# Altium schematic sheet Processor.SchDoc
size A2; SheetNumber: 3; SheetTotal: 4
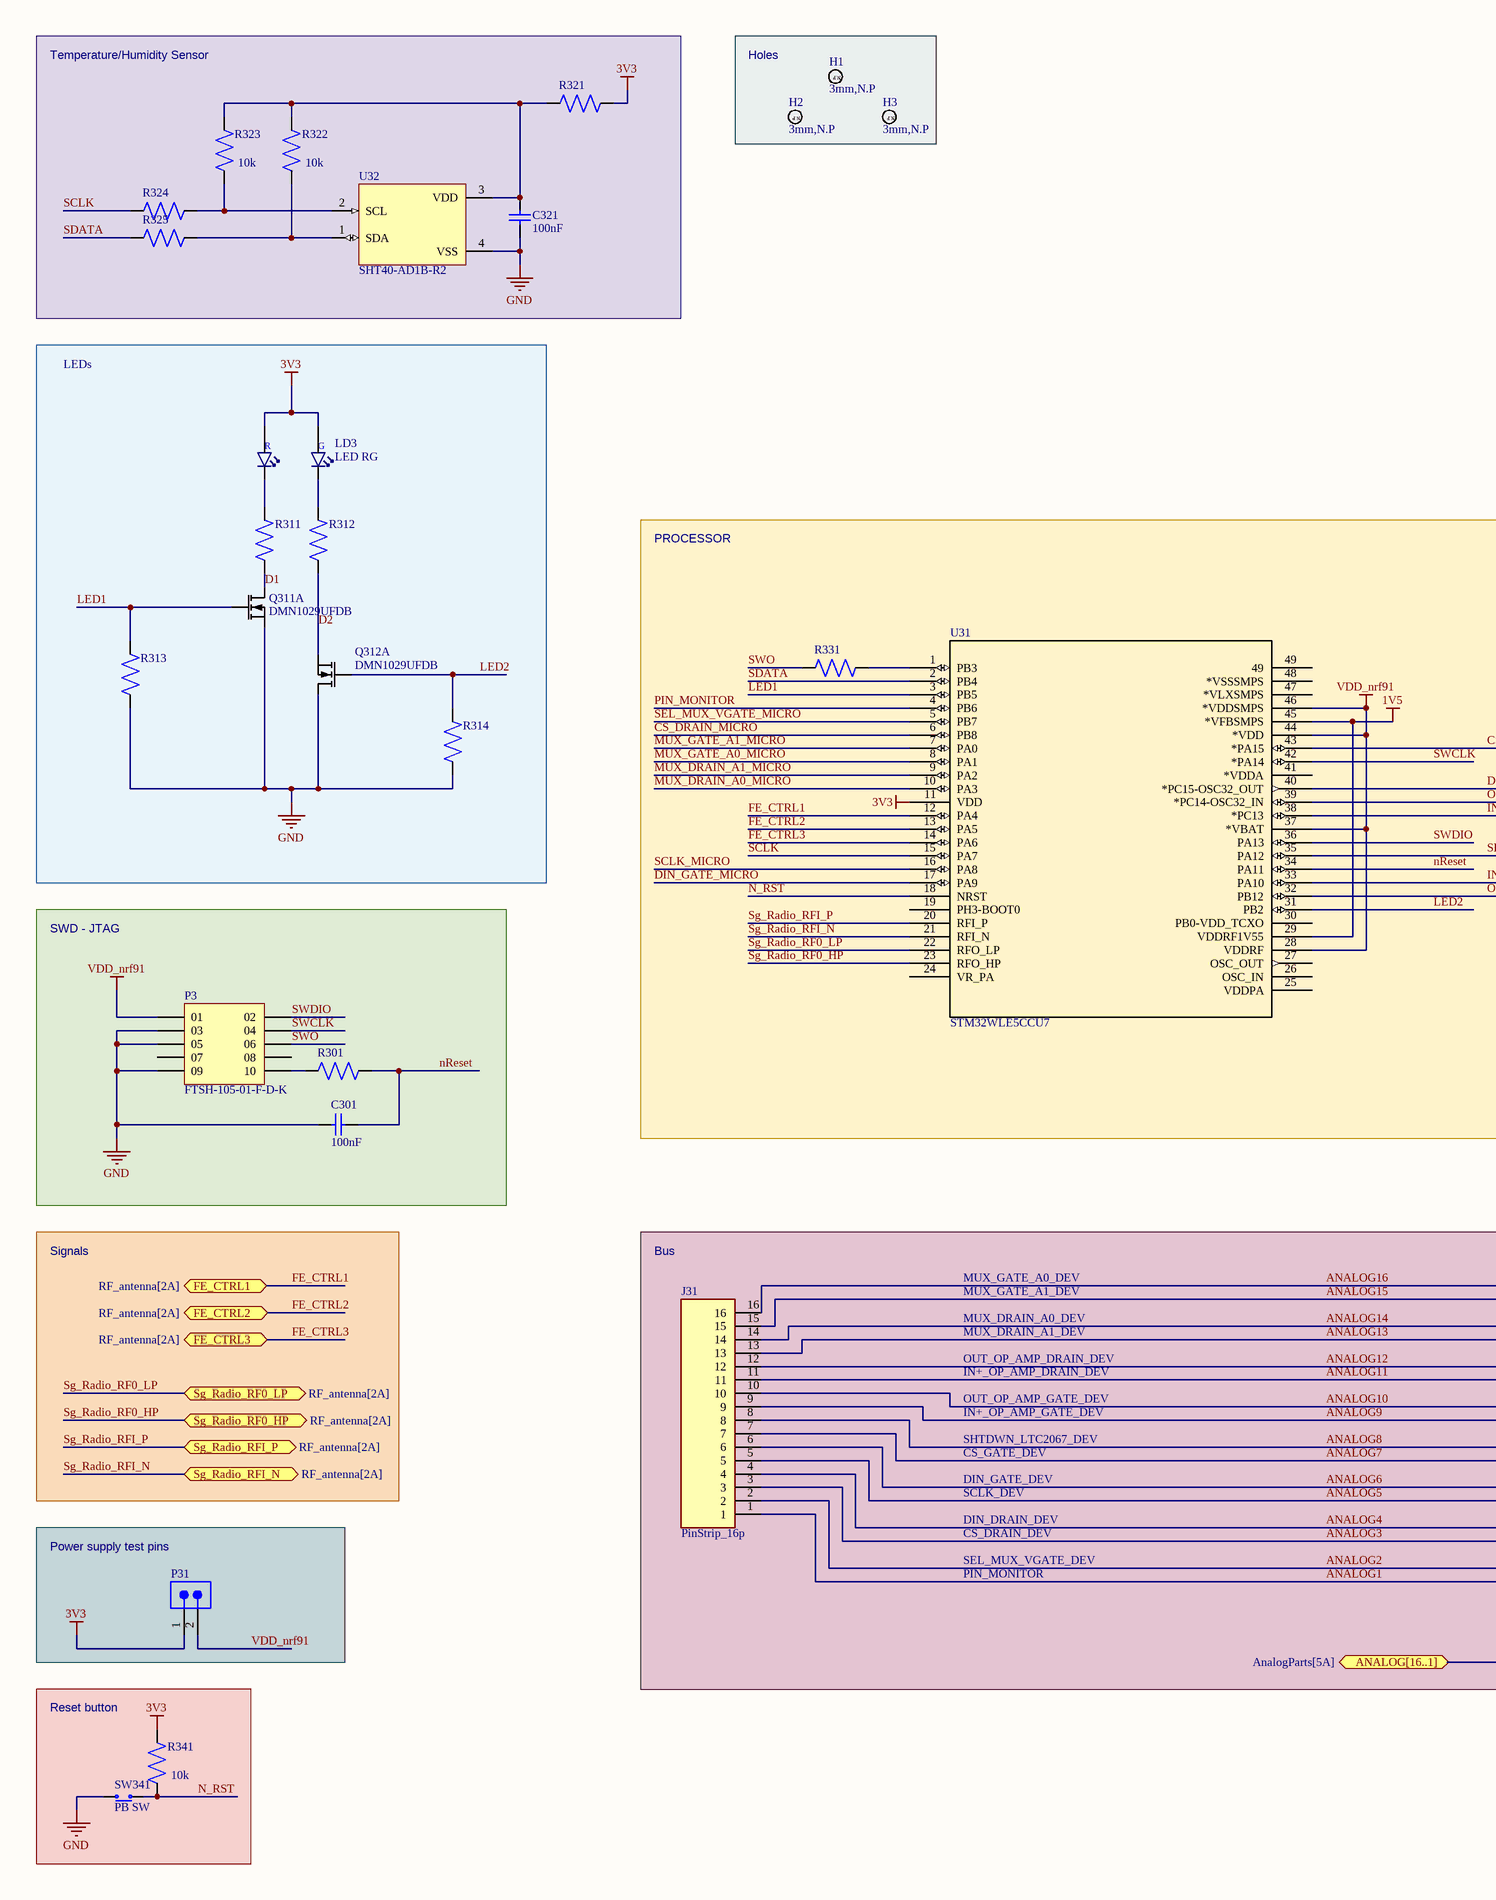
[diagram p0: Processor.SchDoc, left]
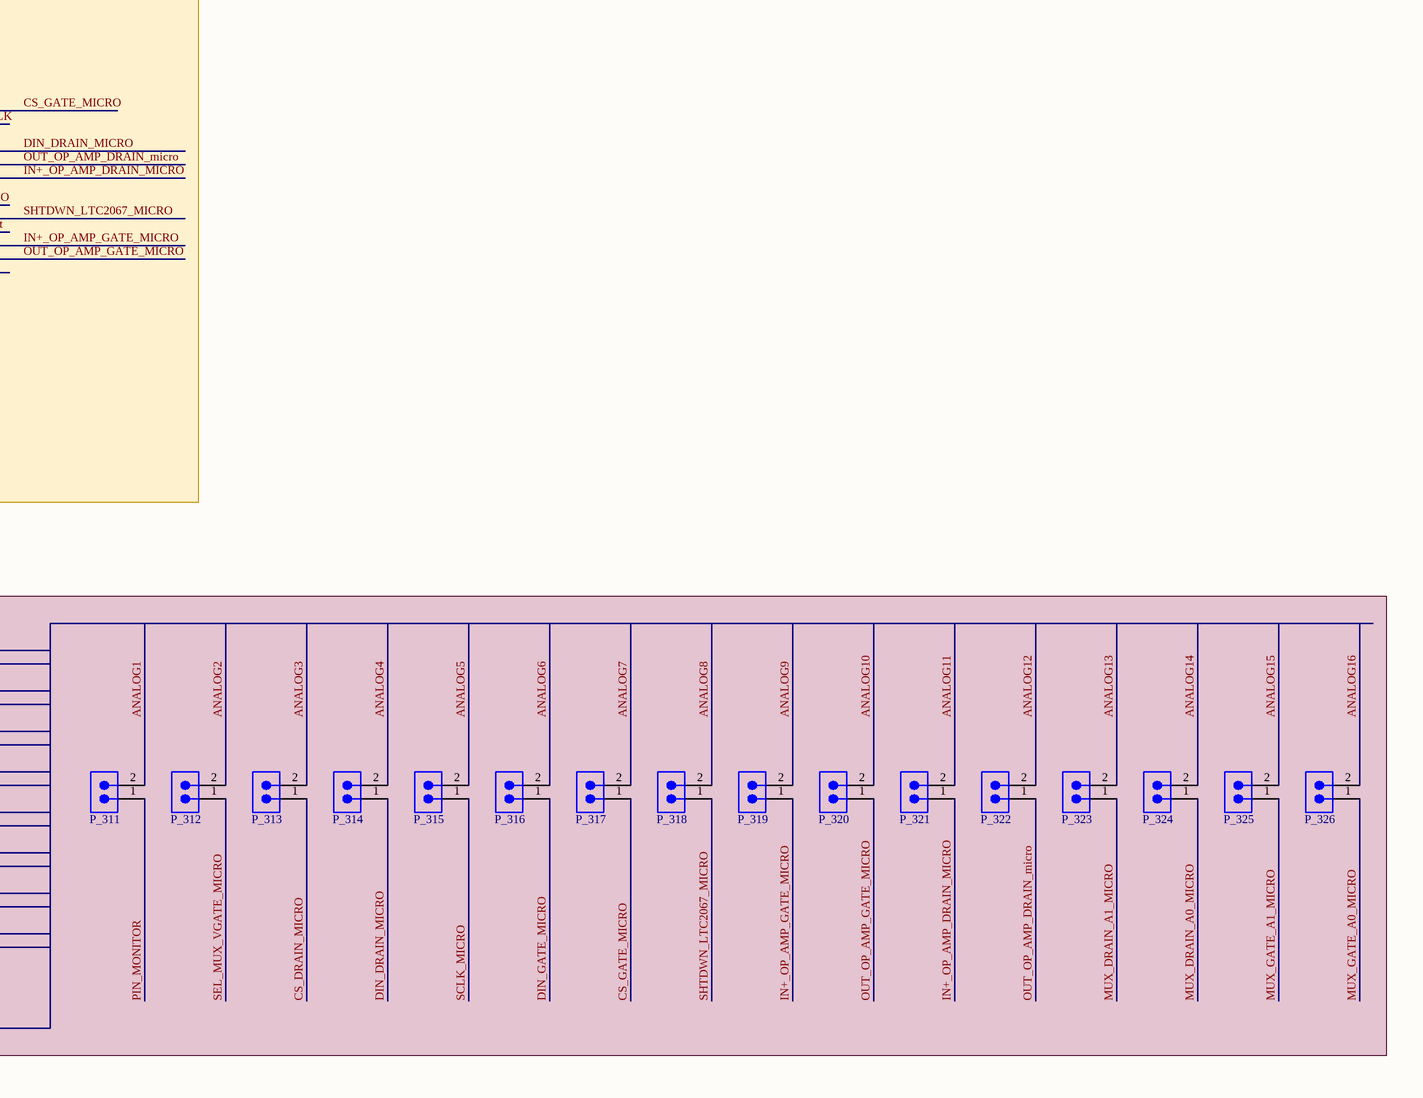
[diagram p1: Processor.SchDoc, right]

## Parts
C301  100nF  [CAPC1608X06L]
C321  100nF  [CAPC1608X06L]
H1  3mm,N.P  [HOLE_NP_3MM]  (no BOM)
H2  3mm,N.P  [HOLE_NP_3MM]  (no BOM)
H3  3mm,N.P  [HOLE_NP_3MM]  (no BOM)
J31  PinStrip_16p  [PinStrip_16p]
LD3  LED RG  [LED_RGB_0805]
P3  FTSH-105-01-F-D-K  [HDR_2x5-THT-1.27mm-K]
P31  Pin header 2p  [Pin_header_1x2]  (value not drawn)
P_311  Pin header 2p  [Pin_header_1x2]  (value not drawn)
P_312  Pin header 2p  [Pin_header_1x2]  (value not drawn)
P_313  Pin header 2p  [Pin_header_1x2]  (value not drawn)
P_314  Pin header 2p  [Pin_header_1x2]  (value not drawn)
P_315  Pin header 2p  [Pin_header_1x2]  (value not drawn)
P_316  Pin header 2p  [Pin_header_1x2]  (value not drawn)
P_317  Pin header 2p  [Pin_header_1x2]  (value not drawn)
P_318  Pin header 2p  [Pin_header_1x2]  (value not drawn)
P_319  Pin header 2p  [Pin_header_1x2]  (value not drawn)
P_320  Pin header 2p  [Pin_header_1x2]  (value not drawn)
P_321  Pin header 2p  [Pin_header_1x2]  (value not drawn)
P_322  Pin header 2p  [Pin_header_1x2]  (value not drawn)
P_323  Pin header 2p  [Pin_header_1x2]  (value not drawn)
P_324  Pin header 2p  [Pin_header_1x2]  (value not drawn)
P_325  Pin header 2p  [Pin_header_1x2]  (value not drawn)
P_326  Pin header 2p  [Pin_header_1x2]  (value not drawn)
Q311  DMN1029UFDB  [MOSFET_DMP2160UFDB-7]  (part A of 2)
Q312  DMN1029UFDB  [MOSFET_DMP2160UFDB-7]  (part A of 2)
R301  (no value)  [RESC1608X04.5L]
R311  (no value)  [RESC1608X04.5L]
R312  (no value)  [RESC1608X04.5L]
R313  (no value)  [RESC1608X04.5L]
R314  (no value)  [RESC1608X04.5L]
R321  (no value)  [RESC1608X04.5L]
R322  10k  [RESC1608X04.5L]
R323  10k  [RESC1608X04.5L]
R324  (no value)  [RESC1608X04.5L]
R325  (no value)  [RESC1608X04.5L]
R331  (no value)  [RESC1608X04.5L]
R341  10k  [RESC1608X04.5L]
SW341  PB SW  [Switch-PB-6.2x6.3mm-SMD]
U31  STM32WLE5CCU7  [UFQFPN_5CCU7_STM]
U32  SHT40-AD1B-R2  [SHT4X]

## Blocks framed on the sheet
Temperature/Humidity Sensor: C321 R321-R325 U32
Holes: H1-H3
LEDs: LD3 Q311 Q312 R311-R314
PROCESSOR: R331 U31
SWD - JTAG: C301 P3 R301
Power supply test pins: P31
Reset button: R341 SW341

## Ports
ANALOG[16..1] (bidir, see AnalogParts[5A]), FE_CTRL1 (bidir, see RF_antenna[2A]), FE_CTRL2 (bidir, see RF_antenna[2A]), FE_CTRL3 (bidir, see RF_antenna[2A]), Sg_Radio_RF0_HP (bidir, see RF_antenna[2A]), Sg_Radio_RF0_LP (bidir, see RF_antenna[2A]), Sg_Radio_RFI_N (bidir, see RF_antenna[2A]), Sg_Radio_RFI_P (bidir, see RF_antenna[2A])

## Nets
1V5: U31.29(VDDRF1V55) U31.45(*VFBSMPS)
3V3: LD3.3(A_RED) LD3.4(A_GREEN) P31.1 R321.2 R341.2 U31.11(VDD)
GND: C301.2 C321.1 P3.03 P3.05 P3.09 Q311.1(S1) Q312.6(D1) R313.1 R314.1 SW341.1(N.O) U32.4(VSS)
VDD_nrf91: P3.01 P31.2 U31.28(VDDRF) U31.37(*VBAT) U31.44(*VDD) U31.46(*VDDSMPS)
ANALOG1: J31.1 P_311.2
ANALOG2: J31.2 P_312.2
ANALOG3: J31.3 P_313.2
ANALOG4: J31.4 P_314.2
ANALOG5: J31.5 P_315.2
ANALOG6: J31.6 P_316.2
ANALOG7: J31.7 P_317.2
ANALOG8: J31.8 P_318.2
ANALOG9: J31.9 P_319.2
ANALOG10: J31.10 P_320.2
ANALOG11: J31.11 P_321.2
ANALOG12: J31.12 P_322.2
ANALOG13: J31.13 P_323.2
ANALOG14: J31.14 P_324.2
ANALOG15: J31.15 P_325.2
ANALOG16: J31.16 P_326.2
CS_DRAIN_MICRO: P_313.1 U31.6(PB8)
CS_GATE_MICRO: P_317.1 U31.43(*PA15)
D1: Q311.6(D1) R311.1
D2: Q312.1(S1) R312.1
DIN_DRAIN_MICRO: P_314.1 U31.40(*PC15-OSC32_OUT)
DIN_GATE_MICRO: P_316.1 U31.17(PA9)
FE_CTRL1: U31.12(PA4) ; port FE_CTRL1
FE_CTRL2: U31.13(PA5) ; port FE_CTRL2
FE_CTRL3: U31.14(PA6) ; port FE_CTRL3
IN+_OP_AMP_DRAIN_MICRO: P_321.1 U31.38(*PC13)
IN+_OP_AMP_GATE_MICRO: P_319.1 U31.33(PA10)
LED1: Q311.2(G1) R313.2 U31.3(PB5)
LED2: Q312.2(G1) R314.2 U31.31(PB2)
MUX_DRAIN_A0_MICRO: P_324.1 U31.10(PA3)
MUX_DRAIN_A1_MICRO: P_323.1 U31.9(PA2)
MUX_GATE_A0_MICRO: P_326.1 U31.8(PA1)
MUX_GATE_A1_MICRO: P_325.1 U31.7(PA0)
N_RST: R341.1 SW341.2(COM) U31.18(NRST)
nReset: C301.1 R301.2 U31.34(PA11)
OUT_OP_AMP_DRAIN_micro: P_322.1 U31.39(*PC14-OSC32_IN)
OUT_OP_AMP_GATE_MICRO: P_320.1 U31.32(PB12)
PIN_MONITOR: P_311.1 U31.4(PB6)
SCLK: R324.1 U31.15(PA7)
SCLK_MICRO: P_315.1 U31.16(PA8)
SDATA: R325.1 U31.2(PB4)
SEL_MUX_VGATE_MICRO: P_312.1 U31.5(PB7)
Sg_Radio_RF0_HP: U31.23(RFO_HP) ; port Sg_Radio_RF0_HP
Sg_Radio_RF0_LP: U31.22(RFO_LP) ; port Sg_Radio_RF0_LP
Sg_Radio_RFI_N: U31.21(RFI_N) ; port Sg_Radio_RFI_N
Sg_Radio_RFI_P: U31.20(RFI_P) ; port Sg_Radio_RFI_P
SHTDWN_LTC2067_MICRO: P_318.1 U31.35(PA12)
SWCLK: P3.04 U31.42(*PA14)
SWDIO: P3.02 U31.36(PA13)
SWO: P3.06 R331.1
NetC321_2: C321.2 R321.1 R322.2 R323.2 U32.3(VDD)
NetLD3_1: LD3.1(C_GREEN) R312.2
NetLD3_2: LD3.2(C_RED) R311.2
NetP3_10: P3.10 R301.1
NetR322_1: R322.1 R325.2 U32.1(SDA)
NetR323_1: R323.1 R324.2 U32.2(SCL)
NetR331_2: R331.2 U31.1(PB3)

Not connected (* = marked no-connect by the designer): P3 07 08; U31 19(PH3-BOOT0) 24(VR_PA) 25(VDDPA) 26(OSC_IN) 27(OSC_OUT) 30(PB0-VDD_TCXO) 41(*VDDA) 47(*VLXSMPS) 48(*VSSSMPS) 49

## Notes on the sheet
- Signals
- Bus
- MUX_GATE_A0_DEV
- MUX_GATE_A1_DEV
- MUX_DRAIN_A0_DEV
- MUX_DRAIN_A1_DEV
- OUT_OP_AMP_DRAIN_DEV
- IN+_OP_AMP_DRAIN_DEV
- OUT_OP_AMP_GATE_DEV
- IN+_OP_AMP_GATE_DEV
- SHTDWN_LTC2067_DEV
- CS_GATE_DEV
- DIN_GATE_DEV
- SCLK_DEV
- DIN_DRAIN_DEV
- CS_DRAIN_DEV
- SEL_MUX_VGATE_DEV
- PIN_MONITOR
- (in symbol APHBM2012LSURKZGKC) R; G
- (in symbol Hole_3MM_NP) N.P

## Library data of the parts
C301 C321 = C0603-4µ7: Capacitor, X5R, ±10%; Value: 100nF
H1-H3 = Hole_3MM_NP: Regular Non-Plated, 3mm hole; Value: 3mm,N.P
J31 = PinStrip_16p: Connector; Manufacturer_Name: Adam Tech; Manufacturer_Part_Number: PH1-16-UA; Datasheet Link: https://www.arrow.com/en/products/ph1-16-ua/adam-tech; Height: 8.469mm; Arrow Part Number: PH1-16-UA; Arrow Price/Stock: https://www.arrow.com/en/products/ph1-16-ua/adam-tech?region=nac
LD3 = APHBM2012LSURKZGKC: Red green LED 2 mm x 1.25 mm SMD; Value: LED RG
P3 = Pin Header 2x5 THT, 1.27mm KS: Connector Header Through Hole 10 position 0.050 (1.27mm); MF: Samtec; Value: FTSH-105-01-F-D-K; Price: None; Toby_UK-Purchase-URL: https://snapeda.com/shop?store=Toby+UK&id=229423; Package: None; SnapEDA_Link: https://www.snapeda.com/parts/FTSH-105-01-F-D-K/Samtec%20Inc./view-part/229423/?ref=snap; Availability: Bad; MP: FTSH-105-01-F-D-K
P31 P_311-P_326 = Pin header 2p: Pin Header, THT, Vertical, pitch 2.54mm, 1 Row, 2P; Value: Pin header 2p
Q311 Q312 = DMN1029UFDB: Dual N Ch MOFET, 5.6A, 29mOhm max, 1.4W; Value: DMN1029UFDB
R301 R311-R314 R321 R324 R325 R331 = R0603: Resistor, ±1%, 0.063W; Value: *
R322 R341 = R0603: Resistor, ±1%, 0.063W; Value: 10K ohm
R323 = R0603: Resistor, ±1%, 0.063W; Value: 10k ohm
SW341 = Switch-PB-6.2x6.3mm-SMD: Tactile Switch, SPNO, SMD, 160gf, 6.2x6.3x2.5mm; Value: PB SW
U31 = STM32WLE5CCU7: No Description Available; Mfr_Name: STMicroelectronics; RefDes: RefDes; Type: Type
U32 = SHT40-AD1B-R2: Humidity/Temperature Sensor Digital Serial (I2C) 4-Pin DFN EP T/R; MF: Sensirion AG; Package: None; Value: SHT40-AD1B-R2; Purchase-URL: https://pricing.snapeda.com/search/part/SHT40-AD1B-R2/?ref=eda; Availability: In Stock; MP: SHT40-AD1B-R2; Check_prices: https://www.snapeda.com/parts/SHT40-AD1B-R2/NSI/view-part/?ref=eda; SnapEDA_Link: https://www.snapeda.com/parts/SHT40-AD1B-R2/NSI/view-part/?ref=snap; Price: None